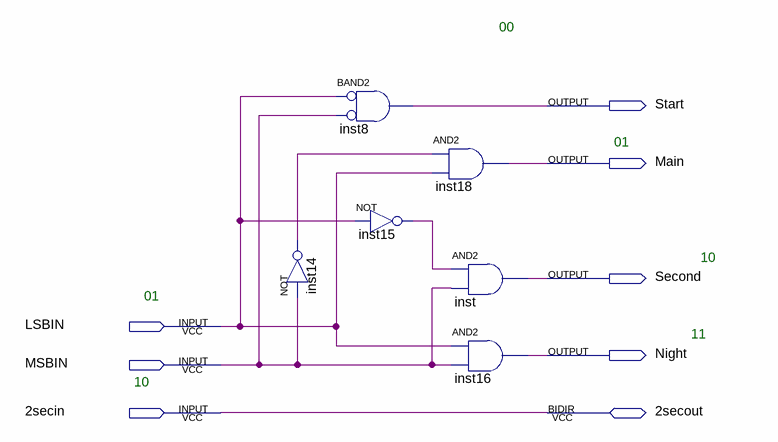
[diagram p0: schematic sheet]
// Quartus schematic DECFarol.bdf as structural Verilog: 6 symbols, 8 pins
module DECFarol (
  input  LSBIN,
  input  MSBIN,
  input  \2secin ,
  inout  \2secout ,
  output Start,
  output Main,
  output Second,
  output Night
);

  wire inst14_out, inst15_out;

  not inst14 (inst14_out, MSBIN);
  and inst8 (Start, ~LSBIN, ~MSBIN);  // BAND2
  not inst15 (inst15_out, LSBIN);
  and inst18 (Main, inst14_out, LSBIN);
  and inst (Second, inst15_out, MSBIN);
  and inst16 (Night, LSBIN, MSBIN);

  assign \2secout  = \2secin ;

  // Notes on the sheet:
  //   00
  //   01
  //   10
  //   01
  //   11
  //   10
endmodule
